# EAGLE schematic clapclap2313 (EAGLE 6.0)
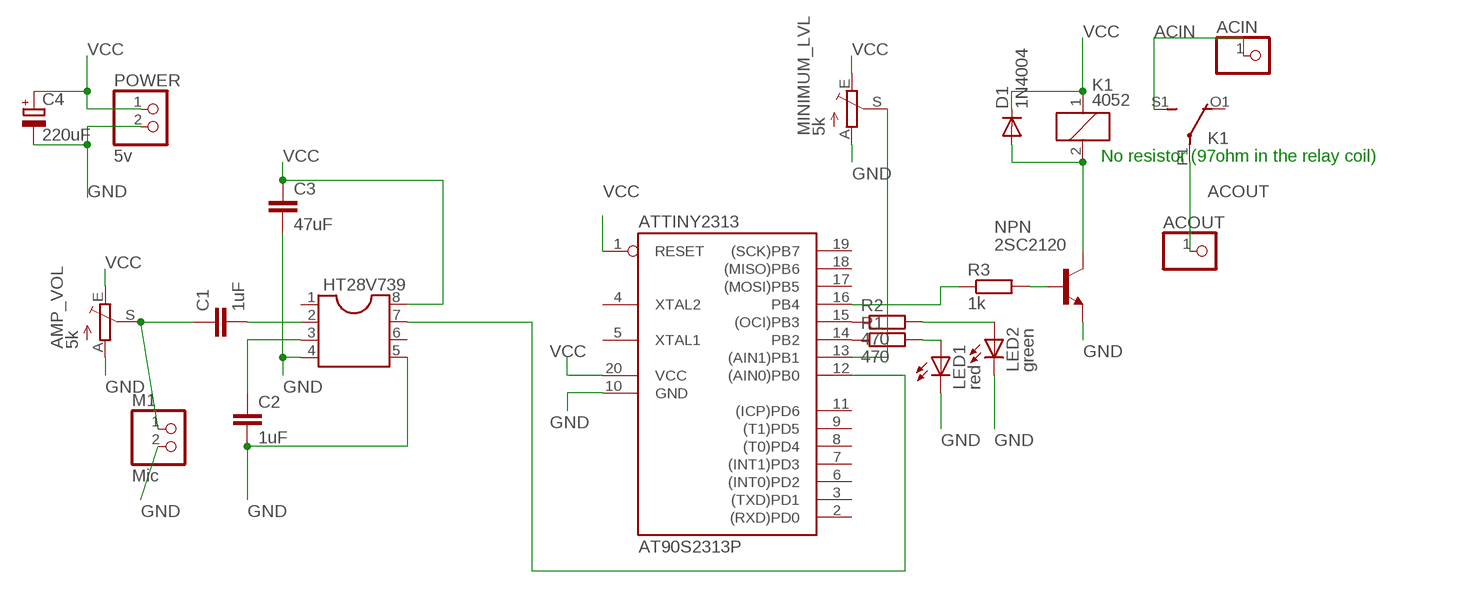
[diagram p0: schematic, sheet 1]

## Parts
ACIN  PINHD-1X1  [1X01]
ACOUT  PINHD-1X1  [1X01]
AMP_VOL  5k  TRIM_EU-CT6  [CT6]
ATTINY2313  AT90S2313P  [DIL20]
C1  1uF  C-EU050-024X044  [C050-024X044]
C2  1uF  C-EU050-024X044  [C050-024X044]
C3  47uF  C-EU050-024X044  [C050-024X044]
C4  220uF  CPOL-EUE2,5-6E  [E2,5-6E]
D1  1N4004  [DO41-10]
HT28V739  DIL8S  [SOCKET-08]
K1  4052  [F4052]
LED1  red  LED3MM  [LED3MM]
LED2  green  LED3MM  [LED3MM]
M1  Mic  PINHD-1X2  [1X02]
MINIMUM_LVL  5k  TRIM_EU-CT6  [CT6]
NPN  2SC2120  -NPN-TO92-ECB  [TO92-ECB]
POWER  5v  PINHD-1X2  [1X02]
R1  470  R-EU_0204/2V  [0204V]
R2  470  R-EU_0204/2V  [0204V]
R3  1k  R-EU_0207/2V  [0207/2V]

## Nets
ACIN: ACIN.1 K1.S1(2:S)
ACOUT: ACOUT.1 K1.P1(2:P)
GND: AMP_VOL.A ATTINY2313.10(GND) C2.2 C3.2 C4.- HT28V739.4 HT28V739.5 LED1.K(C) LED2.K(C) M1.2 MINIMUM_LVL.A NPN.E POWER.2
N$1: C2.1 HT28V739.3
N$2: ATTINY2313.16(PB4) R3.1
N$3: AMP_VOL.S C1.1 M1.1
N$4: ATTINY2313.14(PB2) R1.1
N$5: C1.2 HT28V739.2
N$6: ATTINY2313.15((OCI)PB3) R2.1
N$7: LED1.A R1.2
N$8: NPN.B R3.2
N$9: D1.A K1.2 NPN.C
N$10: ATTINY2313.12((AIN0)PB0) HT28V739.7
N$11: LED2.A R2.2
N$12: ATTINY2313.13((AIN1)PB1) MINIMUM_LVL.S
VCC: AMP_VOL.E ATTINY2313.1(RESET) ATTINY2313.20(VCC) C3.1 C4.+ D1.C HT28V739.8 K1.1 MINIMUM_LVL.E POWER.1
Unconnected: ATTINY2313.2((RXD)PD0) ATTINY2313.3((TXD)PD1) ATTINY2313.4(XTAL2) ATTINY2313.5(XTAL1) ATTINY2313.6((INT0)PD2) ATTINY2313.7((INT1)PD3) ATTINY2313.8((T0)PD4) ATTINY2313.9((T1)PD5) ATTINY2313.11((ICP)PD6) ATTINY2313.17((MOSI)PB5) ATTINY2313.18((MISO)PB6) ATTINY2313.19((SCK)PB7) HT28V739.1 HT28V739.6 K1.O1(2:O) K1.O2(3:O) K1.P2(3:P) K1.S2(3:S)

## Notes on the sheet
- No resistor (97ohm in the relay coil)

## Library data of the parts
ACIN ACOUT = pinhead:PINHD-1X1: PIN HEADER
AMP_VOL MINIMUM_LVL = pot:TRIM_EU-: POTENTIOMETER
ATTINY2313 = atmel:AT90S2313: MICROCONTROLLER 2 Kbytes FLASH 128 bytes SRAM 128 bytes EEPROM UART; OC_FARNELL: unknown; OC_NEWARK: unknown
C1-C3 = resistor:C-EU: CAPACITOR, European symbol
C4 = rcl:CPOL-EU: POLARIZED CAPACITOR, European symbol
D1 = diode:1N4004: DIODE general purpose rectifier, 1 A
HT28V739 = ic-package:DIL8: Dual In Line / Socket
K1 = relay:4052: RELAY 2 x switch, Finder; OC_FARNELL: unknown; OC_NEWARK: unknown
LED1 LED2 = led:LED: LED OSRAM: - CHIPLED LG R971, LG N971, LY N971, LG Q971, LY Q971, LO R971, LY R971 LH N974, LH R974 LS Q976, LO Q976, LY Q976 LO Q996 - Hyper CHIPLED LW Q18S LB Q993, LB Q99A, LB R99A - SideLED LS A670, LO A670, LY A670, LG A670, LP A670 LB A673, LV A673, LT A673, LW A673 LH A674 LY A675 LS A676, LA A676, LO A676, LY A676, LW A676 LS A679, LY A679, LG A679 - Hyper Micro SIDELED® LS Y876, LA Y876, LO Y876, LY Y876 LT Y87S - SmartLED LW L88C, LW L88S LB L89C, LB L89S, LG L890 LS L89K, LO L89K, LY L89K LS L896, LA L896, LO L896, LY L896 - TOPLED LS T670, LO T670, LY T670, LG T670, LP T670 LSG T670, LSP T670, LSY T670, LOP T670, LYG T670 LG T671, LOG T671, LSG T671 LB T673, LV T673, LT T673, LW T673 LH T674 LS T676, LA T676, LO T676, LY T676, LB T676, LH T676, LSB T676, LW T676 LB T67C, LV T67C, LT T67C, LS T67K, LO T67K, LY T67K, LW E67C LS E67B, LA E67B, LO E67B, LY E67B, LB E67C, LV E67C, LT E67C LW T67C LS T679, LY T679, LG T679 LS T770, LO T770, LY T770, LG T770, LP T770 LB T773, LV T773, LT T773, LW T773 LH T774 LS E675, LA E675, LY E675, LS T675 LS T776, LA T776, LO T776, LY T776, LB T776 LHGB T686 LT T68C, LB T68C - Hyper Mini TOPLED® LB M676 - Mini TOPLED Santana® LG M470 LS M47K, LO M47K, LY M47K Source: http://www.osram.convergy.de LUXEON: - LUMILED® LXK2-PW12-R00, LXK2-PW12-S00, LXK2-PW14-U00, LXK2-PW14-V00 LXK2-PM12-R00, LXK2-PM12-S00, LXK2-PM14-U00 LXK2-PE12-Q00, LXK2-PE12-R00, LXK2-PE12-S00, LXK2-PE14-T00, LXK2-PE14-U00 LXK2-PB12-K00, LXK2-PB12-L00, LXK2-PB12-M00, LXK2-PB14-N00, LXK2-PB14-P00, LXK2-PB14-Q00 LXK2-PR12-L00, LXK2-PR12-M00, LXK2-PR14-Q00, LXK2-PR14-R00 LXK2-PD12-Q00, LXK2-PD12-R00, LXK2-PD12-S00 LXK2-PH12-R00, LXK2-PH12-S00 LXK2-PL12-P00, LXK2-PL12-Q00, LXK2-PL12-R00 Source: www.luxeon.com KINGBRIGHT: KA-3528ASYC Source: www.kingbright.com
M1 POWER = pinhead:PINHD-1X2: PIN HEADER
NPN = transistor:*-NPN-: NPN Transistror BF959 corrected 2008.03.06
R1-R3 = resistor:R-EU_: RESISTOR, European symbol